# EAGLE design VCA-3080.io (EAGLE 9.6.2)
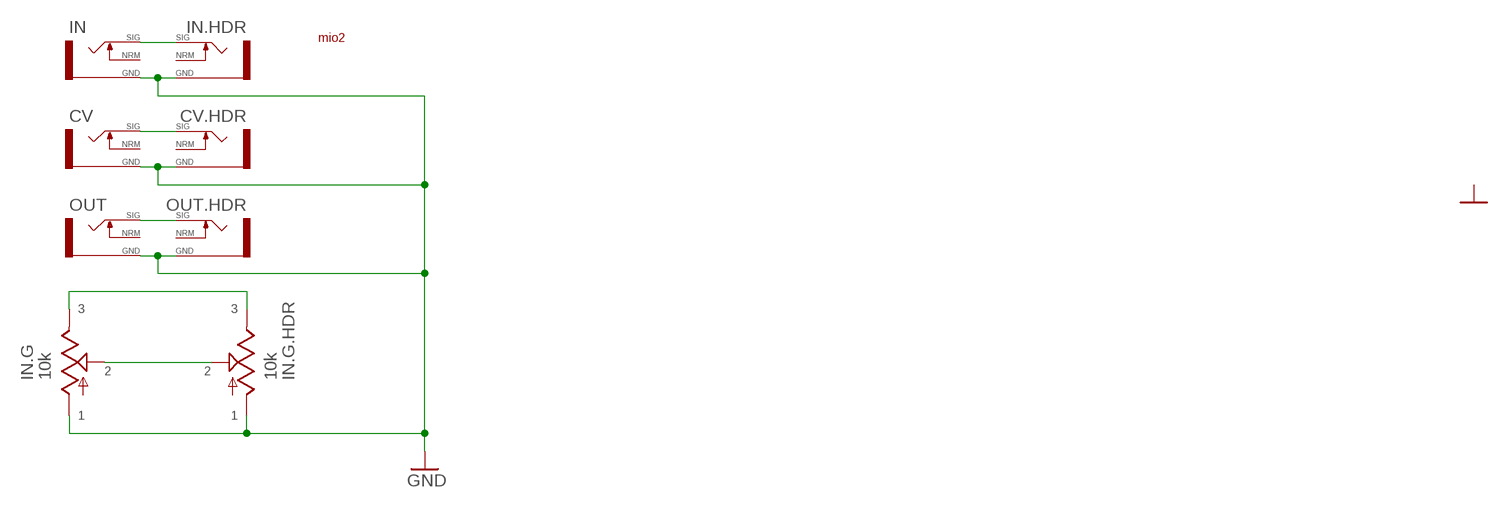
[diagram p0: schematic, sheet 1]

## Parts
CV  MONO301M  [PJ301M]
CV.HDR  MONOHDR  [HEADER]
IN  MONO301M  [PJ301M]
IN.G  10k  PALPHA  [ALPHA-VERT]
IN.G.HDR  10k  PHDR  [HEADER]
IN.HDR  MONOHDR  [HEADER]
OUT  MONO301M  [PJ301M]
OUT.HDR  MONOHDR  [HEADER]
U$2  MIO2  [MIO2]

## Nets
GND: CV.HDR.GND(SLEEVE-GND) CV.SLV(SLEEVE-GND) IN.G.1 IN.G.HDR.1 IN.HDR.GND(SLEEVE-GND) IN.SLV(SLEEVE-GND) OUT.HDR.GND(SLEEVE-GND) OUT.SLV(SLEEVE-GND)
N$1: IN.G.3 IN.G.HDR.3
N$2: IN.G.2 IN.G.HDR.2
N$3: CV.HDR.TIP-SIG CV.TIP(TIP-SIG)
N$4: OUT.HDR.TIP-SIG OUT.TIP(TIP-SIG)
N$5: IN.HDR.TIP-SIG IN.TIP(TIP-SIG)
Unconnected: CV.HDR.NORM(SWITCH-NORM) CV.SW(SWITCH-NORM) IN.HDR.NORM(SWITCH-NORM) IN.SW(SWITCH-NORM) OUT.HDR.NORM(SWITCH-NORM) OUT.SW(SWITCH-NORM)

## Library data of the parts
CV CV.HDR IN IN.HDR OUT OUT.HDR = wb-jacks:MONO
IN.G IN.G.HDR = wb-potswitch:P
U$2 = wb-art:MIO2

## Board
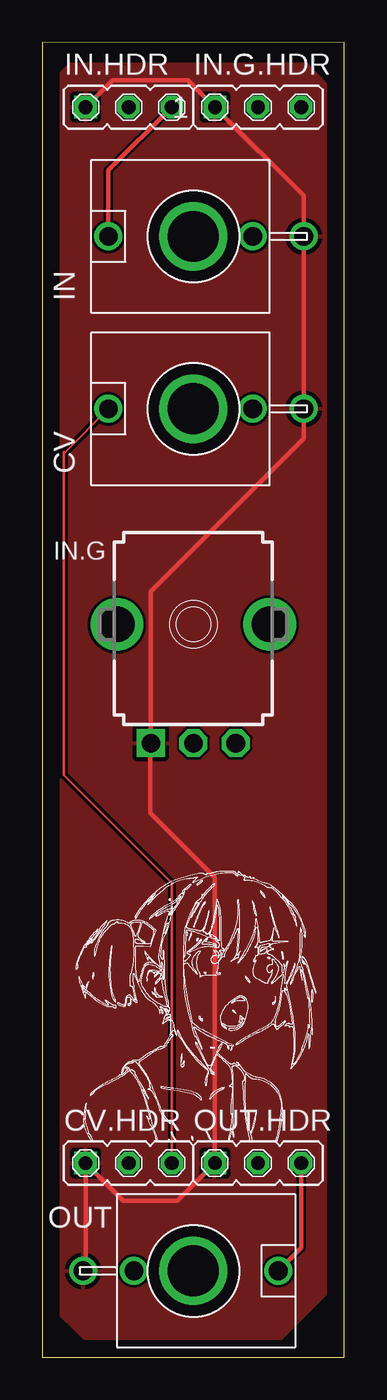
[diagram p1: board, top side]
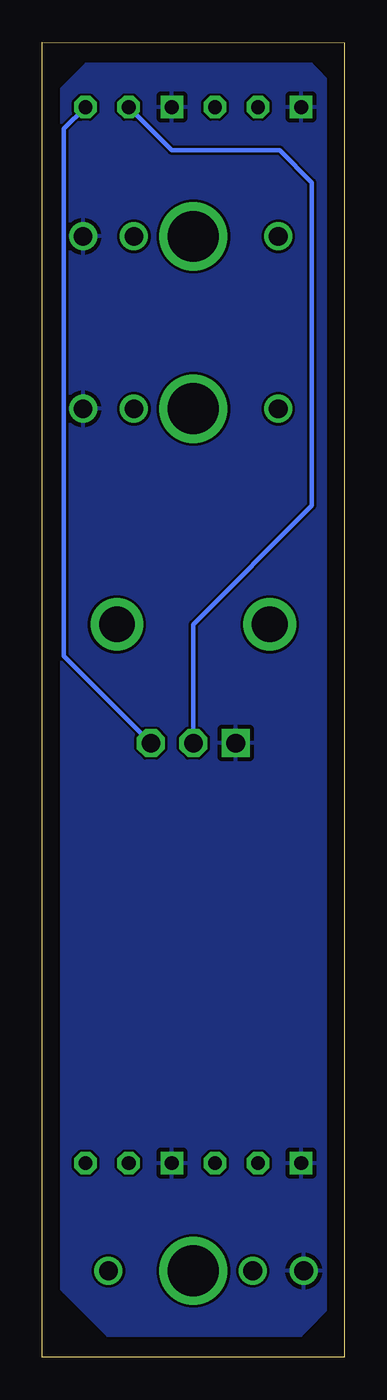
[diagram p2: board, bottom side, seen from below]

Size 17.78 x 77.47 mm. Coordinates in mm from the lower left corner, seen from the top.
Outline: 0,0 17.78,0 17.78,77.47 0,77.46 0,0
Copper layers (1*16): Top 0.035mm / dielectric 1.5mm / Bottom 0.035mm
Design rules "default": minimum track width 6mil, minimum drill 0.35mm, track to track 6mil, track to pad 6mil, pad to pad 6mil, via to via 6mil, smd to smd 6mil, copper to edge 40mil, drill to drill 6mil, minimum pad ring 10mil, minimum via ring 8mil, stop-mask expansion 4mil, vias tented up to drill 0mil, thermal gap 10mil

### Footprints (pad centres in the part's own frame; a part is rotated, then mirrored left to right if it is on the bottom)
PJ301M = drill 3: . 0,0 | drill 1.1: SLV 0,-6.5; SW 0,-3.5; TIP 0,5
HEADER = drill 0.813 square: GND -2.54,0 | drill 0.813 octagon: NORM 0,0; TIP-SIG 2.54,0
ALPHA-VERT = drill 1.1 square: 1 -2.5,-7 | drill 1.1 octagon: 2 0,-7; 3 2.5,-7 | drill 2.1 pad 2.794: C1 -4.5,0; C2 4.5,0
HEADER' = drill 0.813 square: 1 -2.54,0 | drill 0.813 octagon: 2 0,0; 3 2.54,0

### Placement (x,y rotation side)
CV  8.89,55.88 90 top
CV.HDR  5.08,11.43 0 top
IN  8.89,66.04 90 top
IN.G  8.89,43.18 0 top
IN.G.HDR  10k  [HEADER']  12.7,73.66 0 top
IN.HDR  5.08,73.66 0 top
OUT  8.89,5.08 270 top
OUT.HDR  12.7,11.43 0 top
U$2  9.53,19.05 0 top

### Tracks (layer width: path | path; a pad name or v marks a point on that pad's centre or on a via)
GND
  Top 0.254: OUT.SLV 2.54,5.23 CV.HDR.GND 4.76,9.21 7.94,9.21 OUT.HDR.GND 10.16,28.26 6.35,32.07 6.35,36.14 IN.G.1 6.39,45.12 15.39,54.12 CV.SLV IN.SLV 15.39,68.43 IN.G.HDR.1 8.57,75.25 4.13,75.25 IN.HDR.GND
  pour Bottom: 3.81,76.2 1.91,76.2 0.64,74.93 0.64,3.17 2.54,1.27 13.97,1.27 16.51,3.81 17.14,4.45 17.14,74.3 15.24,76.2
  pour Top: 2.86,76.2 1.59,76.2 0.64,75.25 0.32,74.93 0.32,3.17 2.54,0.95 13.97,0.95 17.46,4.45 17.46,74.3 15.56,76.2
N$1
  Bottom 0.254: IN.G.HDR.3 16.51,72.39 16.51,41.3 IN.G.3
N$2
  Bottom 0.254: IN.G.HDR.2 10.16,71.12 3.81,71.12 1.91,69.22 1.91,50.16 8.89,43.18 IN.G.2
N$3
  Top 0.152: CV.TIP 1.35,53.34 1.27,53.34 1.27,34.29 7.62,27.94 CV.HDR.TIP-SIG
N$4
  Top 0.254: OUT.TIP 15.24,6.43 OUT.HDR.TIP-SIG
N$5
  Top 0.254: IN.TIP 3.89,69.93 IN.HDR.TIP-SIG